# EAGLE design schematicMain (EAGLE 9.2.2)

## Sheet 1 of 2
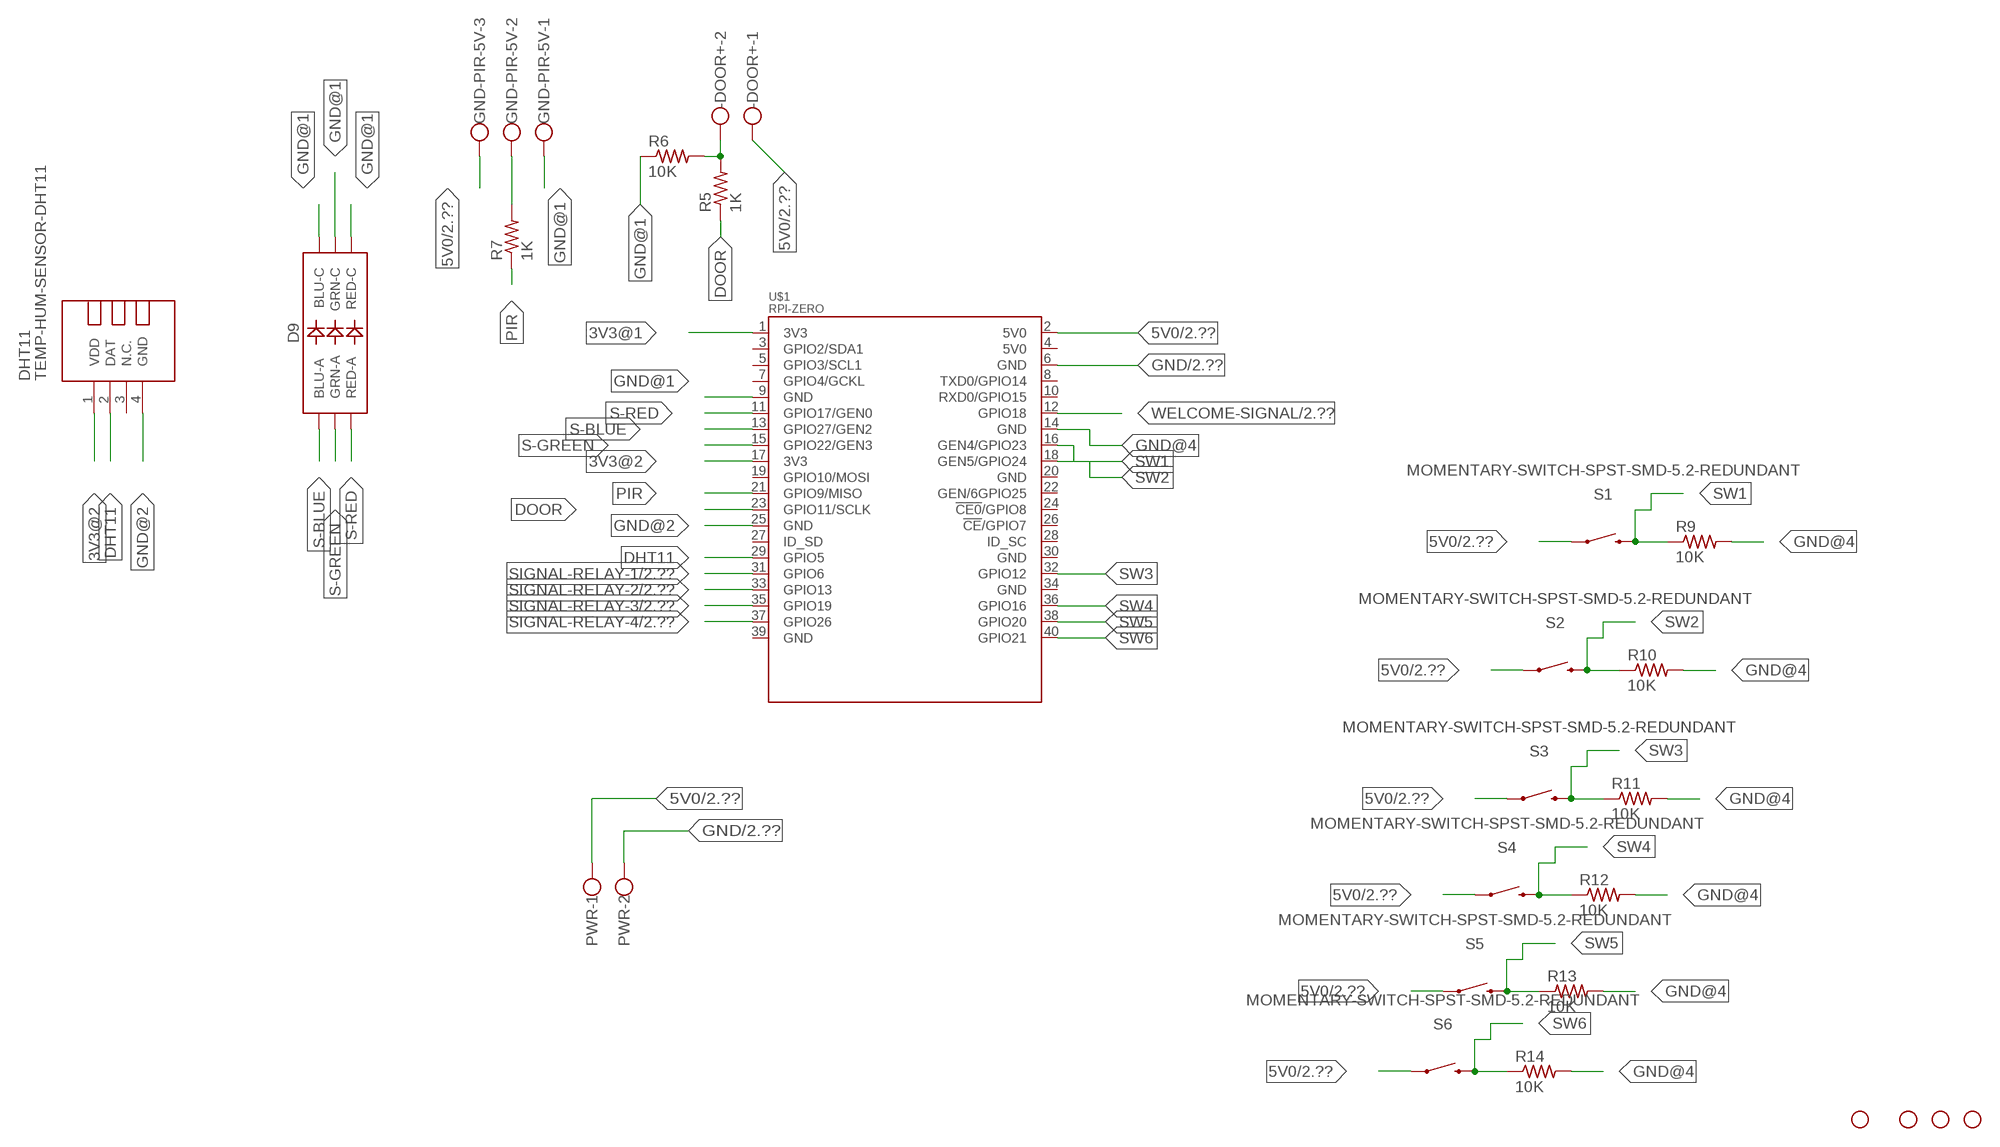
[diagram p0: schematic, sheet 1]

### Parts
-DOOR+  W237-102  [W237-102]
D9  RGB  LED-RGBNO_IC  [LED-TRICOLOR-5050]
DHT11  TEMP-HUM-SENSOR-DHT11  [TEMP-HUM-SENSOR-DHT11]
GND-PIR-5V  W237-103  [W237-103]
H1  STAND-OFFTIGHT  [STAND-OFF-TIGHT]
H2  STAND-OFFTIGHT  [STAND-OFF-TIGHT]
H3  STAND-OFFTIGHT  [STAND-OFF-TIGHT]
H4  STAND-OFFTIGHT  [STAND-OFF-TIGHT]
PWR  W237-102  [W237-102]
R5  1K  R-US_M1206  [M1206]
R6  10K  R-US_M1206  [M1206]
R7  1K  R-US_M1206  [M1206]
R9  10K  R-US_M1206  [M1206]
R10  10K  R-US_M1206  [M1206]
R11  10K  R-US_M1206  [M1206]
R12  10K  R-US_M1206  [M1206]
R13  10K  R-US_M1206  [M1206]
R14  10K  R-US_M1206  [M1206]
S1  MOMENTARY-SWITCH-SPST-SMD-5.2-REDUNDANT  [TACTILE_SWITCH_SMD_5.2MM]
S2  MOMENTARY-SWITCH-SPST-SMD-5.2-REDUNDANT  [TACTILE_SWITCH_SMD_5.2MM]
S3  MOMENTARY-SWITCH-SPST-SMD-5.2-REDUNDANT  [TACTILE_SWITCH_SMD_5.2MM]
S4  MOMENTARY-SWITCH-SPST-SMD-5.2-REDUNDANT  [TACTILE_SWITCH_SMD_5.2MM]
S5  MOMENTARY-SWITCH-SPST-SMD-5.2-REDUNDANT  [TACTILE_SWITCH_SMD_5.2MM]
S6  MOMENTARY-SWITCH-SPST-SMD-5.2-REDUNDANT  [TACTILE_SWITCH_SMD_5.2MM]
U$1  RPI-ZERO  [RASPBERRYPI_BASTELSTUBE_V13_RASPI_BOARD_B+_FULL]

### Nets
3V3@1: U$1.1(3V3)
3V3@2: DHT11.1(VDD) U$1.17(3V3)
5V0: -DOOR+.1 GND-PIR-5V.3 PWR.1 S1.1 S1.2 S2.1 S2.2 S3.1 S3.2 S4.1 S4.2 S5.1 S5.2 S6.1 S6.2 U$1.2(5V0) ; also sheet 2
DHT11: DHT11.2(DAT) U$1.29(GPIO5)
DOOR: R5.1 U$1.23(GPIO11/SCLK)
GND: PWR.2 U$1.6(GND) ; also sheet 2
GND@1: D9.4(BLU-C) D9.5(RED-C) D9.6(GRN-C) GND-PIR-5V.1 R6.1 U$1.9(GND)
GND@2: DHT11.4(GND) U$1.25(GND)
GND@4: R9.2 R10.2 R11.2 R12.2 R13.2 R14.2 U$1.14(GND)
N$8: GND-PIR-5V.2 R7.2
N$14: -DOOR+.2 R5.2 R6.2
PIR: R7.1 U$1.21(GPIO9/MISO)
S-BLUE: D9.3(BLU-A) U$1.13(GPIO27/GEN2)
S-GREEN: D9.1(GRN-A) U$1.15(GPIO22/GEN3)
S-RED: D9.2(RED-A) U$1.11(GPIO17/GEN0)
SIGNAL-RELAY-1: U$1.31(GPIO6) ; also sheet 2
SIGNAL-RELAY-2: U$1.33(GPIO13) ; also sheet 2
SIGNAL-RELAY-3: U$1.35(GPIO19) ; also sheet 2
SIGNAL-RELAY-4: U$1.37(GPIO26) ; also sheet 2
SW1: R9.1 S1.3 S1.4 U$1.16(GEN4/GPIO23)
SW2: R10.1 S2.3 S2.4 U$1.18(GEN5/GPIO24)
SW3: R11.1 S3.3 S3.4 U$1.32(GPIO12)
SW4: R12.1 S4.3 S4.4 U$1.36(GPIO16)
SW5: R13.1 S5.3 S5.4 U$1.38(GPIO20)
SW6: R14.1 S6.3 S6.4 U$1.40(GPIO21)
WELCOME-SIGNAL: U$1.12(GPIO18) ; also sheet 2
Unconnected: DHT11.3(N.C.) U$1.3(GPIO2/SDA1) U$1.4(5V0) U$1.5(GPIO3/SCL1) U$1.7(GPIO4/GCKL) U$1.8(TXD0/GPIO14) U$1.10(RXD0/GPIO15) U$1.19(GPIO10/MOSI) U$1.20(GND) U$1.22(GEN/6GPIO25) U$1.24(!CE0!/GPIO8) U$1.26(!CE!/GPIO7) U$1.27(ID_SD) U$1.28(ID_SC) U$1.30(GND) U$1.34(GND) U$1.39(GND)

## Sheet 2 of 2
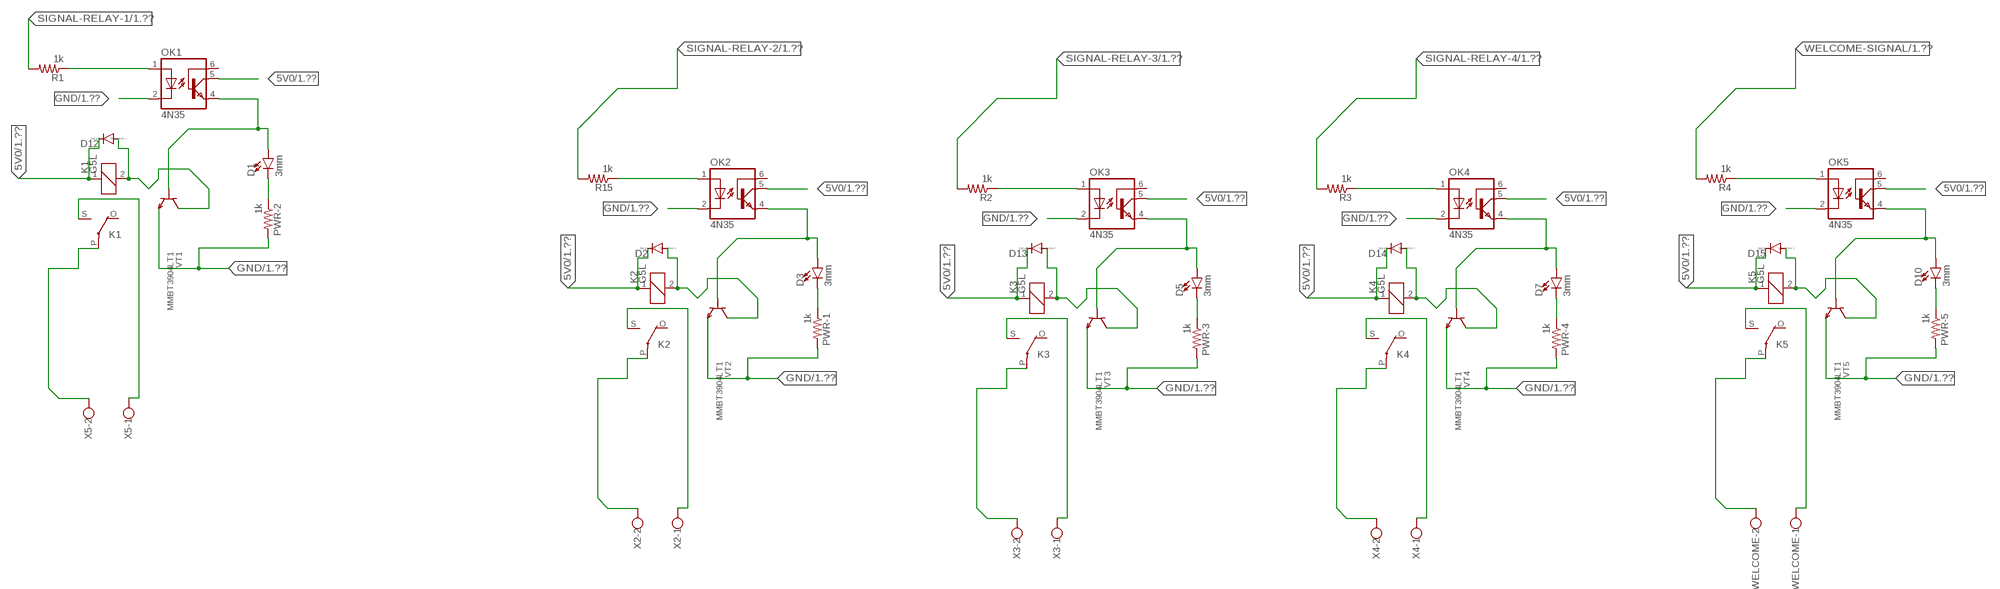
[diagram p1: schematic, sheet 2]

### Parts
D1  3mm  LED-FKIT-1206  [FKIT-LED-1206]
D2  DIODE-SOD80C  [SOD80C]
D3  3mm  LED-FKIT-1206  [FKIT-LED-1206]
D5  3mm  LED-FKIT-1206  [FKIT-LED-1206]
D7  3mm  LED-FKIT-1206  [FKIT-LED-1206]
D10  3mm  LED-FKIT-1206  [FKIT-LED-1206]
D12  DIODE-SOD80C  [SOD80C]
D13  DIODE-SOD80C  [SOD80C]
D14  DIODE-SOD80C  [SOD80C]
D15  DIODE-SOD80C  [SOD80C]
K1  G5L  [G5LE]
K2  G5L  [G5LE]
K3  G5L  [G5LE]
K4  G5L  [G5LE]
K5  G5L  [G5LE]
OK1  4N35  [DIL06]
OK2  4N35  [DIL06]
OK3  4N35  [DIL06]
OK4  4N35  [DIL06]
OK5  4N35  [DIL06]
PWR-1  1k  R-US_M1206  [M1206]
PWR-2  1k  R-US_M1206  [M1206]
PWR-3  1k  R-US_M1206  [M1206]
PWR-4  1k  R-US_M1206  [M1206]
PWR-5  1k  R-US_M1206  [M1206]
R1  1k  R-US_M1206  [M1206]
R2  1k  R-US_M1206  [M1206]
R3  1k  R-US_M1206  [M1206]
R4  1k  R-US_M1206  [M1206]
R15  1k  R-US_M1206  [M1206]
VT1  MMBT3904LT1  [SOT23-BEC]
VT2  MMBT3904LT1  [SOT23-BEC]
VT3  MMBT3904LT1  [SOT23-BEC]
VT4  MMBT3904LT1  [SOT23-BEC]
VT5  MMBT3904LT1  [SOT23-BEC]
WELCOME  W237-102  [W237-102]
X2  W237-102  [W237-102]
X3  W237-102  [W237-102]
X4  W237-102  [W237-102]
X5  W237-102  [W237-102]

### Nets
5V0: D2.C D12.C D13.C D14.C D15.C K1.1 K2.1 K3.1 K4.1 K5.1 OK1.5(COL) OK2.5(COL) OK3.5(COL) OK4.5(COL) OK5.5(COL) ; also sheet 1
GND: OK1.2(C) OK2.2(C) OK3.2(C) OK4.2(C) OK5.2(C) PWR-1.2 PWR-2.2 PWR-3.2 PWR-4.2 PWR-5.2 VT1.E VT2.E VT3.E VT4.E VT5.E ; also sheet 1
N$1: K1.P(2:P) X5.2
N$2: K1.S(2:S) X5.1
N$3: K2.P(2:P) X2.2
N$4: D1.A OK1.4(EMI) VT1.B
N$5: D12.A K1.2 VT1.C
N$6: K5.P(2:P) WELCOME.2
N$7: OK1.1(A) R1.1
N$9: K2.S(2:S) X2.1
N$10: K5.S(2:S) WELCOME.1
N$11: OK2.1(A) R15.1
N$12: D2.A K2.2 VT2.C
N$13: K3.P(2:P) X3.2
N$15: K3.S(2:S) X3.1
N$16: OK3.1(A) R2.1
N$17: OK5.1(A) R4.1
N$18: D13.A K3.2 VT3.C
N$19: D5.A OK3.4(EMI) VT3.B
N$20: D5.C PWR-3.1
N$21: D15.A K5.2 VT5.C
N$22: K4.P(2:P) X4.2
N$23: K4.S(2:S) X4.1
N$24: D10.A OK5.4(EMI) VT5.B
N$25: OK4.1(A) R3.1
N$26: D14.A K4.2 VT4.C
N$27: D7.A OK4.4(EMI) VT4.B
N$28: D3.A OK2.4(EMI) VT2.B
N$29: D1.C PWR-2.1
N$30: D3.C PWR-1.1
N$31: D7.C PWR-4.1
N$32: D10.C PWR-5.1
SIGNAL-RELAY-1: R1.2 ; also sheet 1
SIGNAL-RELAY-2: R15.2 ; also sheet 1
SIGNAL-RELAY-3: R2.2 ; also sheet 1
SIGNAL-RELAY-4: R3.2 ; also sheet 1
WELCOME-SIGNAL: R4.2 ; also sheet 1
Unconnected: K1.O(2:O) K2.O(2:O) K3.O(2:O) K4.O(2:O) K5.O(2:O) OK1.6(BAS) OK2.6(BAS) OK3.6(BAS) OK4.6(BAS) OK5.6(BAS)

## Library data of the parts
-DOOR+ PWR WELCOME X2-X5 = con-wago-500:W237-102: WAGO SCREW CLAMP; MPN: 237-102; OC_FARNELL: unknown; OC_NEWARK: 70K9898
D1 D3 D5 D7 D10 = SparkFun-LED:LED: LED (Generic) Standard schematic elements and footprints for 5mm, 3mm, 1206, and 0603 sized LEDs. Generic LEDs with no color specified.
D2 D12-D15 = diode:DIODE-: DIODE
D9 = SparkFun-LED:LED-RGB: LED-RGB 6 pin RGB LED (no common connector) Packages: PLCC-6 LED-TRICOLOR-5050 - No built-in IC SparkFun Products: Digital Sandbox <https://www.sparkfun.com/products/12651> LED- SMD RGB <https://www.sparkfun.com/products/10866>; PROD_ID: DIO-10298
DHT11 = diy-modules:TEMP-HUM-SENSOR-DHT11: DHT11 - digital humidity & temperature sensor DHT11 datasheet available here: https://akizukidenshi.com/download/ds/aosong/DHT11.pdf Click here to find device on ebay.com <http://www.ebay.com/sch/dht11+digital+sensor>
GND-PIR-5V = con-wago-500:W237-103: WAGO SCREW CLAMP; MPN: 237-103; OC_FARNELL: unknown; OC_NEWARK: 18M7116
H1-H4 = SparkFun-Hardware:STAND-OFF: Stand Off Drill holes for mechanically mounting via screws, standoffs, etc. Note: Use the keepout ring to avoid running the screw head into surrounding components. Variant Overviews STAND-OFF - Mechanical footprint for a #4 phillips button head screw. STAND-OFF-TIGHT - Mechanical footprint for a #4 phillips button head screw, Example SparkFun Products Screw - Phillips Head (1/4", 4-40, 10 pack) <https://www.sparkfun.com/products/10453> (PRT-10453) Screw - Phillips Head (1/2", 4-40, 10 pack) <https://www.sparkfun.com/products/10452> (PRT-10452) Screw - Phillips Head (3/4", 4-40, 10 pack) <https://www.sparkfun.com/products/10451> (PRT-10451) Screw - Phillips Head (1", 4-40, 10 pack) <https://www.sparkfun.com/products/10450> (PRT-10450)
K1-K5 = relay:G5L: RELAY 1 x switch, 10 A/120 V AC, 8 A/30 V ADC, Omron; OC_FARNELL: unknown; OC_NEWARK: unknown
OK1-OK5 = optocoupler:4N35: MOTOROLA OPTO COUPLER; MF: FAIRCHILD SEMICONDUCTOR; MPN: 4N35; OC_FARNELL: 1328375; OC_NEWARK: 72K9946
PWR-1-PWR-5 = resistor:R-US_: RESISTOR, American symbol; PWR-2: PWR-2
R1-R7 R9-R15 = resistor:R-US_: RESISTOR, American symbol
S1-S6 = SparkFun-Switches:MOMENTARY-SWITCH-SPST: Momentary Switch (Pushbutton) - SPST Normally-open (NO) SPST momentary switches (buttons, pushbuttons). Variants PTH-12MM - 12mm square, through-hole Momentary Pushbutton Switch - 12mm Square <https://www.sparkfun.com/products/9190> (COM-09190) PTH-6.0MM, PTH-6.0MM-KIT - 6.0mm square, through-hole Mini Pushbutton Switch <https://www.sparkfun.com/products/97> (COM-00097) KIT package intended for soldering kit's - only one side of pads' copper is exposed. PTH-RIGHT-ANGLE-KIT - Right-angle, through-hole Right Angle Tactile Button <https://www.sparkfun.com/products/10791> - Used on SparkFun BigTime Watch Kit <https://www.sparkfun.com/products/11734> SMD-12MM - 12mm square, surface-mount Tactile Button - SMD (12mm) <https://www.sparkfun.com/products/12993> (COM-12993) Used on SparkFun PicoBoard <https://www.sparkfun.com/products/11888> SMD-4.5MM - 4.5mm Square Trackball Switch Used on SparkFun Blackberry Trackballer Breakout <https://www.sparkfun.com/products/13169> SMD-4.6MMX2.8MM - 4.60mm x 2.80mm, surface mount Used on SparkFun SAMD21 Mini Breakout <https://www.sparkfun.com/products/13664> SMD-5.2MM, SMD-5.2-REDUNDANT - 5.2mm square, surface-mount Mini Pushbutton Switch - SMD <https://www.sparkfun.com/products/8720> (COM-08720) Used on Arduino Pro Mini <https://www.sparkfun.com/products/11114> REDUNDANT package connects both switch circuits together SMD-6.0X3.5MM - 6.0 x 3.5mm, surface mount Momentary Reset Switch SMD <https://www.sparkfun.com/products/8229> (COM-08229) SMD-6.2MM-TALL - 6.2mm square, surface mount Tactile Button - SMD (6mm) <https://www.sparkfun.com/products/12992> Used on SparkFun Digital Sandbox <https://www.sparkfun.com/products/12651> SMD-RIGHT-ANGLE - Right-angle, surface mount Used on SparkFun Block for Intel® Edison - Arduino <https://www.sparkfun.com/products/13036>; PROD_ID: SWCH-08247; SF_SKU: COM-08720
U$1 = RPI-Zero:RPI-ZERO
VT1-VT5 = transistor-npn:MMBT3904*: NPN TRANSISTOR

## Board
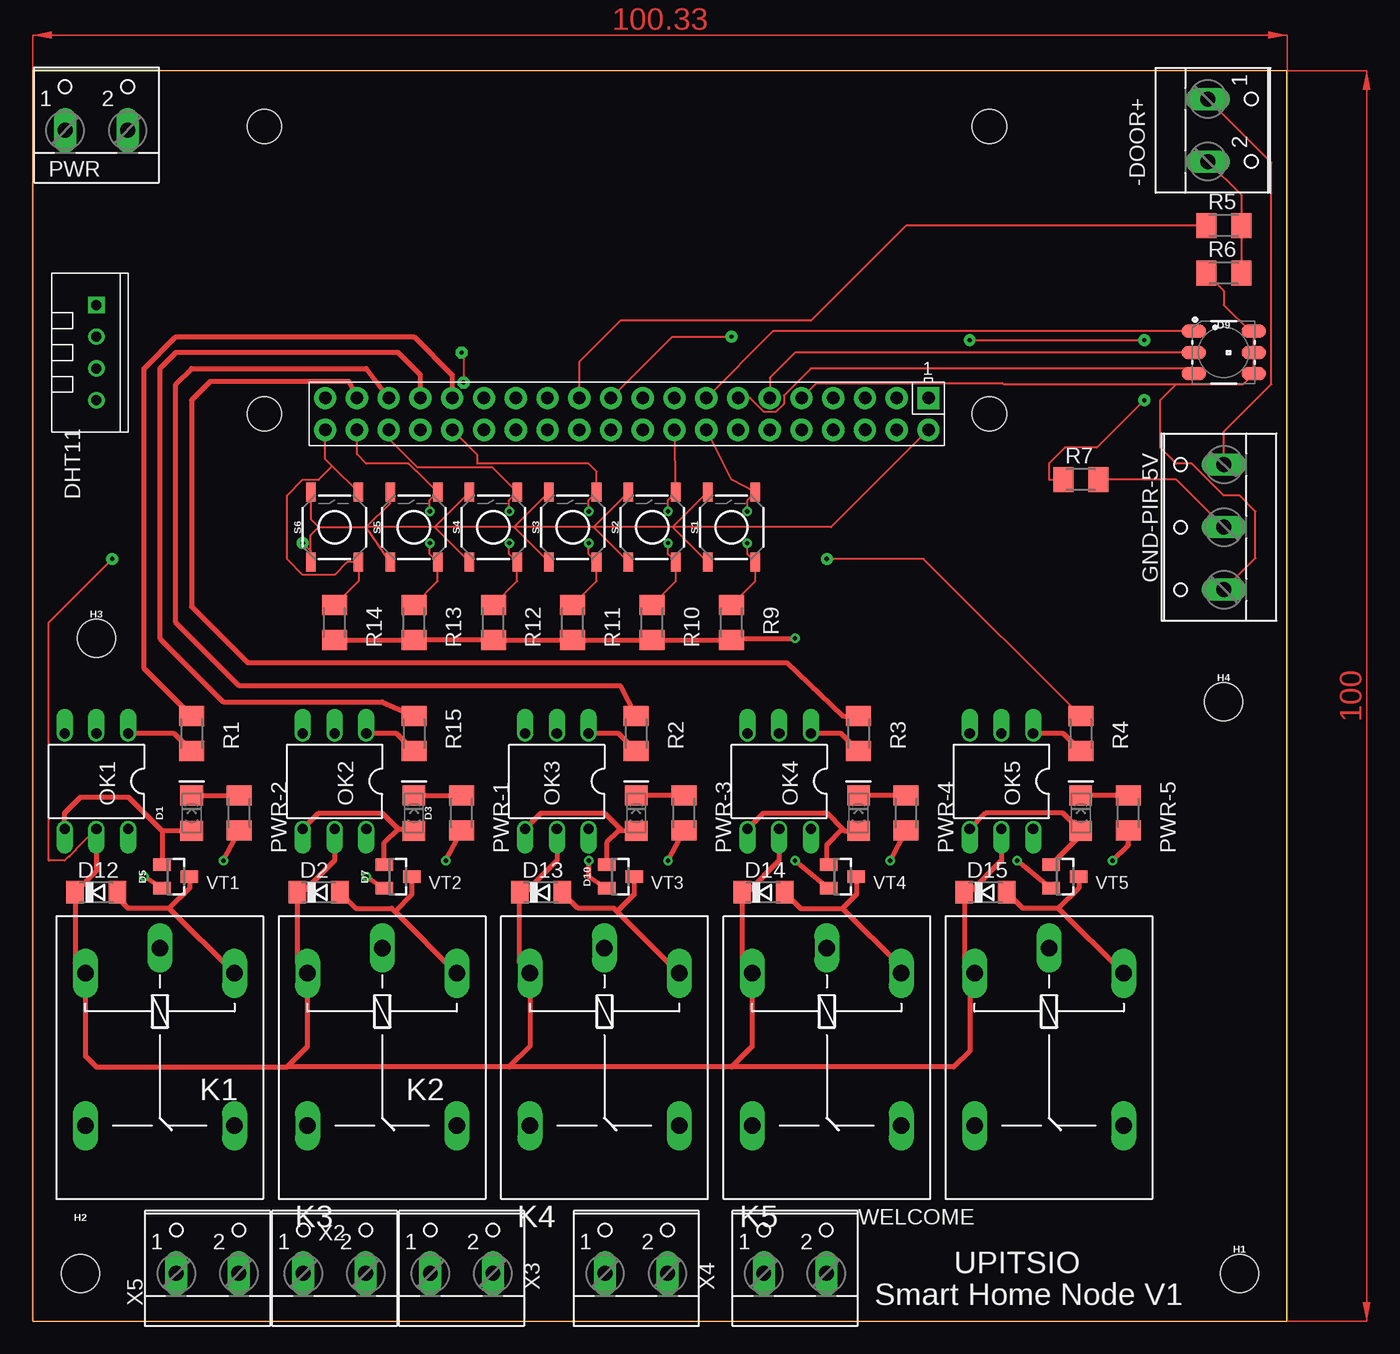
[diagram p2: board, top side]
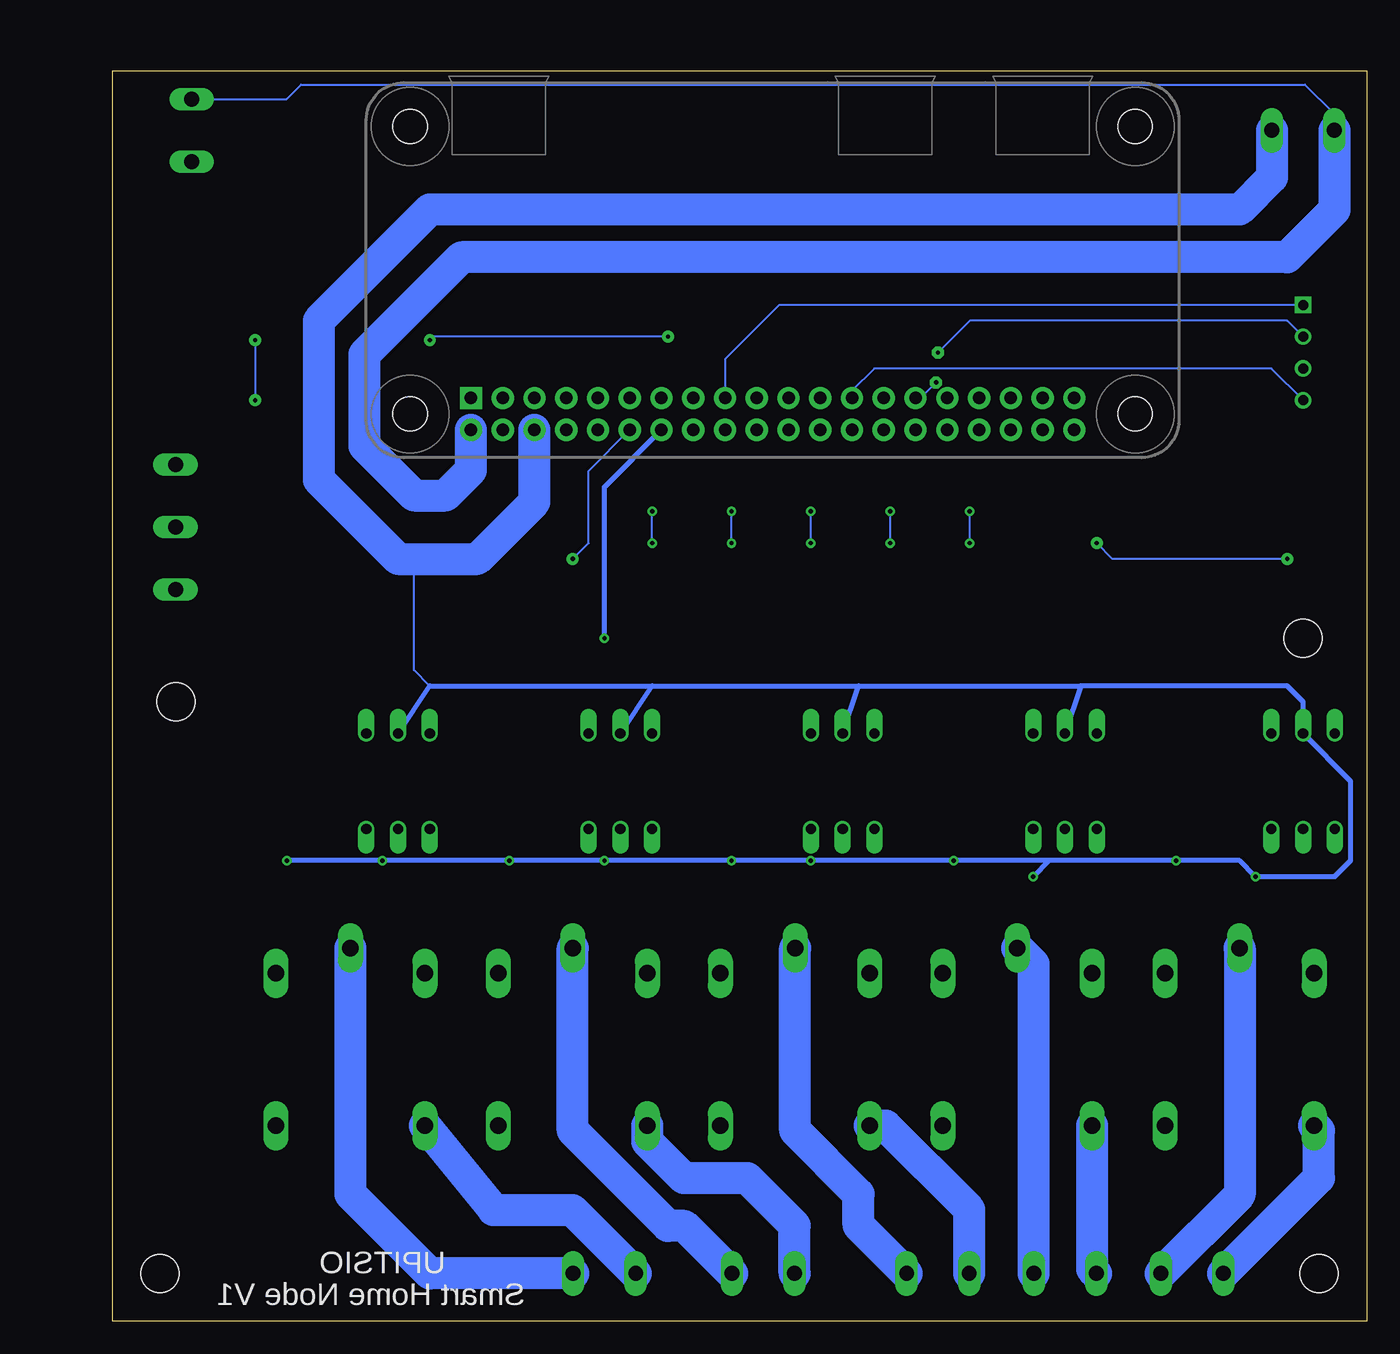
[diagram p3: board, bottom side, seen from below]

Size 100.31 x 100 mm. Coordinates in mm from the lower left corner, seen from the top.
Outline: 0,0 100.31,0 100.31,100 0,100 0,0
Copper layers (1*16): Top 0.035mm / dielectric 1.5mm / Bottom 0.035mm
Design rules "default": minimum track width 6mil, minimum drill 0.35mm, track to track 6mil, track to pad 6mil, pad to pad 6mil, via to via 6mil, smd to smd 6mil, copper to edge 40mil, drill to drill 6mil, minimum pad ring 10mil, minimum via ring 8mil, stop-mask expansion 4mil, vias tented up to drill 0mil, thermal gap 10mil

### Footprints (pad centres in the part's own frame; a part is rotated, then mirrored left to right if it is on the bottom)
W237-102 = drill 1.194 long: 1 -2.5,-1.27; 2 2.5,-1.27
FKIT-LED-1206 = smd 1.6 x 1.803: A -1.422,0; C 1.422,0
SOD80C = smd 1.4 x 1.8: A 1.7,0; C -1.7,0
LED-TRICOLOR-5050 = smd 2 x 1.1: 1 -2.4,1.7; 2 -2.4,0; 3 -2.4,-1.7; 4 2.4,-1.7; 5 2.4,0; 6 2.4,1.7
TEMP-HUM-SENSOR-DHT11 = drill 0.8 square: 1 -3.81,0 | drill 0.8: 2 -1.27,0; 3 1.27,0; 4 3.81,0
W237-103 = drill 1.194 long: 1 -5,-1.29; 2 0,-1.29; 3 5,-1.29
STAND-OFF-TIGHT = hole 3.048: 0,0
G5LE = drill 1.321 long: 1 -7.493,-5.969; 2 -7.493,5.969; O 4.699,5.969; P -9.525,0; S 4.699,-5.969
DIL06 = drill 0.813 offset: 1 -2.54,-3.81; 2 0,-3.81; 3 2.54,-3.81; 4 2.54,3.81; 5 0,3.81; 6 -2.54,3.81
M1206 = smd 1.6 x 2: 1 -1.4,0; 2 1.4,0
TACTILE_SWITCH_SMD_5.2MM = smd 1.524 x 0.762: 1 -2.794,1.905; 2 2.794,1.905; 3 -2.794,-1.905; 4 2.794,-1.905
RASPBERRYPI_BASTELSTUBE_V13_RASPI_BOARD_B+_FULL = drill 1 pad 1.778 square: 1 8.37,25.23 | drill 1 pad 1.778: 2 8.37,27.77; 3 10.91,25.23; 4 10.91,27.77; 5 13.45,25.23; 6 13.45,27.77; 7 15.99,25.23; 8 15.99,27.77; 9 18.53,25.23; 10 18.53,27.77; 11 21.07,25.23; 12 21.07,27.77; 13 23.61,25.23; 14 23.61,27.77; 15 26.15,25.23; 16 26.15,27.77; 17 28.69,25.23; 18 28.69,27.77; 19 31.23,25.23; 20 31.23,27.77; 21 33.77,25.23; 22 33.77,27.77; 23 36.31,25.23; 24 36.31,27.77; 25 38.85,25.23; 26 38.85,27.77; 27 41.39,25.23; 28 41.39,27.77; 29 43.93,25.23; 30 43.93,27.77; 31 46.47,25.23; 32 46.47,27.77; 33 49.01,25.23; 34 49.01,27.77; 35 51.55,25.23; 36 51.55,27.77; 37 54.09,25.23; 38 54.09,27.77; 39 56.63,25.23; 40 56.63,27.77 | hole 2.75: 3.5,3.5; 3.5,26.5; 61.5,3.5; 61.5,26.5
SOT23-BEC = smd 1 x 1.4: B -0.95,-1.1; C 0,1.1; E 0.95,-1.1

### Placement (x,y rotation side)
-DOOR+  95.25,95.25 270 top
D1  12.7,40.64 90 top
D2  22.86,34.29 0 top
D3  30.48,40.64 90 top
D5  48.26,40.64 90 top
D7  66.04,40.64 90 top
D9  95.25,77.47 0 top
D10  83.82,40.64 90 top
D12  5.08,34.29 0 top
D13  40.64,34.29 0 top
D14  58.42,34.29 0 top
D15  76.2,34.29 0 top
DHT11  5.08,77.47 270 top
GND-PIR-5V  93.98,63.5 90 top
H1  96.52,3.81 0 top
H2  3.81,3.81 0 top
H3  5.08,54.61 0 top
H4  95.25,49.53 0 top
K1  10.16,20.32 270 top
K2  27.94,20.32 270 top
K3  45.72,20.32 270 top
K4  63.5,20.32 270 top
K5  81.28,20.32 270 top
OK1  5.08,43.18 180 top
OK2  24.13,43.18 180 top
OK3  41.91,43.18 180 top
OK4  59.69,43.18 180 top
OK5  77.47,43.18 180 top
PWR  5.08,96.52 0 top
PWR-1  34.29,40.64 270 top
PWR-2  16.51,40.64 270 top
PWR-3  52.07,40.64 270 top
PWR-4  69.85,40.64 270 top
PWR-5  87.63,40.64 270 top
R1  12.7,46.99 90 top
R2  48.26,46.99 90 top
R3  66.04,46.99 90 top
R4  83.82,46.99 90 top
R5  95.25,87.63 0 top
R6  95.25,83.82 0 top
R7  83.82,67.31 0 top
R9  55.88,55.88 270 top
R10  49.53,55.88 270 top
R11  43.18,55.88 270 top
R12  36.83,55.88 270 top
R13  30.48,55.88 270 top
R14  24.13,55.88 270 top
R15  30.48,46.99 90 top
S1  55.88,63.5 90 top
S2  49.53,63.5 90 top
S3  43.18,63.5 90 top
S4  36.83,63.5 90 top
S5  30.48,63.5 90 top
S6  24.13,63.5 90 top
U$1  80.01,99.06 180 top
VT1  11.43,35.56 270 top
VT2  29.21,35.56 270 top
VT3  46.99,35.56 270 top
VT4  64.77,35.56 270 top
VT5  82.55,35.56 270 top
WELCOME  60.96,5.08 0 top
X2  24.13,5.08 0 top
X3  34.29,5.08 0 top
X4  48.26,5.08 0 top
X5  13.97,5.08 0 top

### Tracks (layer width: path | path; a pad name or v marks a point on that pad's centre or on a via)
3V3@2
  Bottom 0.152: U$1.17 51.32,76.95 46.99,81.28 DHT11.1
5V0  (via drill 0.35 pad 0.95)
  Top 0.152: S6.2 22.23,64.14 22.86,63.5 | 22.86,63.5 26.67,63.5 | S5.2 28.57,65.41 26.67,63.5 | S4.2 32.13,63.5 | 32.13,63.5 26.67,63.5 | S3.2 38.48,63.5 | 38.48,63.5 32.13,63.5 | S2.2 44.83,63.5 | 44.83,63.5 38.48,63.5 | S1.2 51.18,63.5 | 51.18,63.5 44.83,63.5 | S2.1 44.83,63.5 | S3.1 38.48,63.5 | S4.1 32.13,63.5 | S5.1 26.67,63.5 | 22.86,63.5 22.23,62.87 S6.1 22.23,61.59 v21.59,62.23 | S1.1 51.18,63.5 | U$1.2 63.85,63.5 51.18,63.5 | GND-PIR-5V.3 95.27,71.14 99.06,74.93 99.06,92.67 -DOOR+.1 | OK1.5 3.43,37.72 3.43,37.68 2.91,37.16 2.87,37.16 2.54,36.83 1.27,36.83 1.27,55.88 v6.35,60.96
  Top 0.406: 20.32,20.32 5.08,20.32 4.19,21.21 K1.1 3.38,28.62 D12.C 5.08,35.99 OK1.5 | 20.32,20.32 21.97,21.97 K2.1 21.16,28.62 D2.C 21.59,34.29 24.13,36.83 OK2.5 | 38.1,20.32 39.75,21.97 K3.1 38.94,28.62 D13.C 39.37,34.29 41.91,36.83 OK3.5 | 38.1,20.32 20.32,20.32 | 55.88,20.32 57.53,21.97 K4.1 56.72,28.62 D14.C 57.15,34.29 59.69,36.83 OK4.5 | 55.88,20.32 38.1,20.32 | K5.1 75.18,27.69 | 75.18,27.69 74.93,27.43 74.93,21.59 73.66,20.32 55.88,20.32 | 75.18,27.69 74.5,28.37 D15.C 74.93,34.29 77.47,36.83 OK5.5
  Bottom 0.152: -DOOR+.1 86.4,97.75 85.24,98.91 4.93,98.91 2.58,96.56 PWR.1 | v6.35,60.96 20.32,60.96 v21.59,62.23
  Bottom 2.54: PWR.1 2.58,88.86 6.35,85.09 72.39,85.09 80.17,77.31 80.17,70.01 76.2,66.04 73.66,66.04 71.64,68.06 U$1.2
DHT11  (via drill 0.35 pad 0.95)
  Top 0.152: v34.29,77.47 34.44,77.32 v34.44,75.08
  Bottom 0.152: DHT11.2 6.35,80.01 31.75,80.01 v34.29,77.47 | v34.44,75.08 35.69,73.83 U$1.29
DOOR
  Top 0.152: U$1.23 43.7,76.72 46.99,80.01 62.23,80.01 69.85,87.63 R5.1
GND  (via drill 0.35)
  Top 0.406: VT1.E v8.89,35.56 | v15.24,36.83 PWR-2.2 | v26.67,35.56 VT2.E | v33.02,36.83 PWR-1.2 | v44.45,36.83 44.45,35.56 VT3.E | v50.8,36.83 PWR-3.2 | v60.96,36.83 VT4.E | v68.58,36.83 PWR-4.2 | v78.74,36.83 VT5.E | v86.36,36.83 87.63,38.1 PWR-5.2
  Bottom 0.152: 74.93,50.8 76.2,52.07 76.2,59.69 77.47,60.96
  Bottom 0.406: 22.86,50.8 6.35,50.8 5.08,49.53 OK1.2 1.27,43.18 1.27,36.83 2.54,35.56 v8.89,35.56 10.16,36.83 v15.24,36.83 25.4,36.83 | 22.86,50.8 OK2.2 | 25.4,36.83 v26.67,35.56 | 25.4,36.83 v33.02,36.83 v44.45,36.83 v50.8,36.83 v60.96,36.83 v68.58,36.83 v78.74,36.83 v86.36,36.83 | OK3.2 40.64,50.8 | 40.64,50.8 22.86,50.8 | OK4.2 57.15,50.8 | 57.15,50.8 40.64,50.8 | OK5.2 74.93,50.8 57.15,50.8
  Bottom 2.54: PWR.2 7.58,91.48 10.16,88.9 74.93,88.9 83.82,80.01 83.82,67.31 77.47,60.96 71.12,60.96 66.56,65.52 U$1.6
GND@1
  Top 0.152: U$1.9 62.68,75.03 77.53,75.03 77.63,74.93 91.44,74.93 | R6.1 95.25,82.42 95.25,81.28 97.36,79.17 D9.6 D9.5 D9.4 96.81,74.93 92.71,74.93 91.44,74.93 | GND-PIR-5V.1 97.79,61.02 97.79,64.77 96.52,66.04 95.25,66.04 93.91,67.38 93.25,68.03 93.25,68.04 92.71,68.58 91.44,68.58 90.17,69.85 90.17,73.66 91.44,74.93
GND@2
  Bottom 0.152: DHT11.4 7.62,76.2 39.37,76.2 41.16,74.41 U$1.25
GND@4  (via drill 0.35)
  Top 0.406: R14.2 R13.2 R12.2 R11.2 R10.2 R9.2 arc-90 56.01,54.61 v60.96,54.61
  Bottom 0.406: v60.96,54.61 60.96,66.73 U$1.14
N$1
  Bottom 2.54: K1.P 10.16,10.12 X5.2
N$2
  Bottom 2.54: X5.1 3.85,11.43 3.81,11.43 3.81,15.24 K1.S
N$3
  Bottom 2.54: X2.2 26.63,28.54 K2.P
N$4
  Top 0.406: D1.A 10.33,39.22 | 10.33,39.22 VT1.B | OK1.4 2.54,40.64 3.81,41.91 7.64,41.91 10.33,39.22
N$5
  Top 0.406: K1.2 10.92,33.02 | 10.92,33.02 7.62,33.02 6.78,33.86 D12.A | VT1.C 12.53,34.63 10.92,33.02
N$6
  Bottom 2.54: WELCOME.2 74.93,3.81 81.28,10.16 K5.P
N$7
  Top 0.406: R1.1 11.3,46.99 OK1.1
N$8
  Top 0.152: GND-PIR-5V.2 91.46,67.31 R7.2
N$9
  Bottom 2.54: K2.S 21.97,4.15 X2.1
N$10
  Bottom 2.54: WELCOME.1 63.54,8.89 69.85,8.89 K5.S
N$11
  Top 0.406: R15.1 29.08,46.99 OK2.1
N$12
  Top 0.406: D2.A 25.83,33.02 28.7,33.02 28.96,32.77 | 28.96,32.77 K2.2 | VT2.C 30.31,34.12 28.96,32.77
N$13
  Bottom 2.54: X3.2 40.64,7.66 40.64,10.16 45.72,15.24 K3.P
N$14
  Top 0.152: R6.2 R5.2 96.65,90.08 -DOOR+.2
N$15
  Bottom 2.54: X3.1 31.79,8.93 38.48,15.62 K3.S
N$16
  Top 0.406: R2.1 46.86,46.99 OK3.1
N$17
  Top 0.406: R4.1 82.42,46.99 OK5.1
N$18
  Top 0.406: K3.2 46.74,32.77 | 46.74,32.77 46.48,33.02 43.61,33.02 D13.A | VT3.C 48.09,34.12 46.74,32.77
N$19
  Top 0.406: D5.A 46.99,39.22 | 46.99,39.22 46.84,39.22 45.89,38.27 VT3.B | OK3.4 40.64,40.64 45.72,40.64 46.99,39.37 46.99,39.22
N$20
  Top 0.406: PWR-3.1 48.28,42.04 D5.C
N$21
  Top 0.406: K5.2 82.04,33.02 | D15.A 79.17,33.02 82.04,33.02 | VT5.C 83.65,34.63 82.04,33.02
N$22
  Bottom 2.54: X4.2 54.57,7.62 55.88,7.62 63.5,15.24 K4.P
N$23
  Bottom 2.54: X4.1 45.76,7.66 49.53,11.43 54.61,11.43 57.53,14.35 K4.S
N$24
  Top 0.406: VT5.B 83.82,38.88 D10.A 82.4,40.64 76.2,40.64 OK5.4
N$25
  Top 0.406: R3.1 64.64,46.99 OK4.1
N$26
  Top 0.406: D14.A 61.39,33.02 64.77,33.02 | K4.2 69.47,28.32 64.77,33.02 | VT4.C 65.87,34.12 64.77,33.02
N$27
  Top 0.406: OK4.4 58.42,40.64 63.5,40.64 64.77,39.37 | 64.77,39.37 64.92,39.22 D7.A | VT4.B 63.5,36.68 63.5,38.1 64.77,39.37
N$28
  Top 0.406: VT2.B 28.11,38.27 29.21,39.37 | 29.21,39.37 30.48,39.37 D3.A | OK2.4 22.86,40.64 27.94,40.64 29.21,39.37
N$29
  Top 0.406: D1.C 16.49,42.06 PWR-2.1
N$30
  Top 0.406: D3.C 34.27,42.06 PWR-1.1
N$31
  Top 0.406: PWR-4.1 66.06,42.04 D7.C
N$32
  Top 0.406: PWR-5.1 83.84,42.04 D10.C
PIR  (via drill 0.35 pad 0.95)
  Top 0.152: U$1.21 51.15,78.74 v55.88,78.74 | v74.93,78.47 v88.9,78.47 | v88.9,73.66 85.09,69.85 82.55,69.85 81.28,68.58 81.28,67.31 R7.1
  Bottom 0.152: v55.88,78.74 74.66,78.74 v74.93,78.47 | v88.9,78.47 v88.9,73.66
S-BLUE
  Top 0.152: D9.3 92.42,76.2 62.23,76.2 60.06,74.03 60.06,73.37 59.4,72.71 58.48,72.71 57.36,73.83 U$1.13
S-GREEN
  Top 0.152: D9.1 59.2,79.17 U$1.15
S-RED
  Top 0.152: D9.2 60.96,77.47 58.94,75.45 U$1.11
SIGNAL-RELAY-1
  Top 0.406: R1.2 8.89,52.2 8.89,76.2 11.43,78.74 30.48,78.74 33.54,75.68 U$1.31
SIGNAL-RELAY-2
  Top 0.406: U$1.33 31,75.68 29.21,77.47 11.43,77.47 10.16,76.2 10.16,54.61 15.24,49.53 27.94,49.53 R15.2
SIGNAL-RELAY-3
  Top 0.406: R2.2 46.99,50.8 16.51,50.8 11.43,55.88 11.43,74.93 12.7,76.2 26.67,76.2 U$1.35
SIGNAL-RELAY-4
  Top 0.406: U$1.37 25.29,75.15 14.19,75.15 12.7,73.66 12.7,57.15 17.18,52.67 60.26,52.67 64.77,48.39 R3.2
SW1  (via drill 0.35)
  Top 0.152: U$1.16 55.88,67.31 S1.4 57.15,65.66 v57.15,64.77 | R9.1 57.78,59.19 S1.3 57.15,61.34 v57.15,62.23
  Bottom 0.152: v57.15,62.23 v57.15,64.77
SW2  (via drill 0.35)
  Top 0.152: U$1.18 S2.4 50.8,65.66 v50.8,64.77 | R10.1 51.44,59.19 S2.3 50.8,61.34 v50.8,62.23
  Bottom 0.152: v50.8,62.23 v50.8,64.77
SW3  (via drill 0.35)
  Top 0.152: U$1.32 35.56,69.27 35.56,68.58 44.45,68.58 45.09,67.94 S3.4 44.45,65.66 v44.45,64.77 | R11.1 45.09,59.19 S3.3 44.45,61.34 v44.45,62.23
  Bottom 0.152: v44.45,62.23 v44.45,64.77
SW4  (via drill 0.35)
  Top 0.152: U$1.36 28.46,70.6 30.79,68.28 36.75,68.28 S4.4 38.1,65.66 v38.1,64.77 | R12.1 38.73,59.19 S4.3 38.1,61.34 v38.1,62.23
  Bottom 0.152: v38.1,62.23 v38.1,64.77
SW5  (via drill 0.35)
  Top 0.152: U$1.38 25.92,69.33 26.67,68.58 30.05,68.58 30.66,67.97 30.71,67.97 S5.4 31.75,65.66 v31.75,64.77 | R13.1 32.38,59.19 S5.3 31.75,61.34 v31.75,62.23
  Bottom 0.152: v31.75,62.23 v31.75,64.77
SW6
  Top 0.152: S6.4 23.94,68.39 | 23.94,68.39 23.38,68.95 U$1.40 | R14.1 26.04,59.19 S6.3 25.15,60.71 24.13,59.69 21.59,59.69 20.32,60.96 20.32,66.04 21.59,67.31 22.86,67.31 23.94,68.39
WELCOME-SIGNAL  (via drill 0.35 pad 0.95)
  Top 0.152: R4.2 71.25,60.96 v63.5,60.96
  Bottom 0.152: v63.5,60.96 62.23,62.23 62.23,68 U$1.12
(copper drawn outside any net)
  shapes: Top area x2

### Text on the board
tPlace: UPITSIO | Smart Home Node V1
bPlace: UPITSIO | Smart Home Node V1